# Altium schematic sheet PWM_Output.SchDoc
size A; SheetNumber: 9; SheetTotal: 9
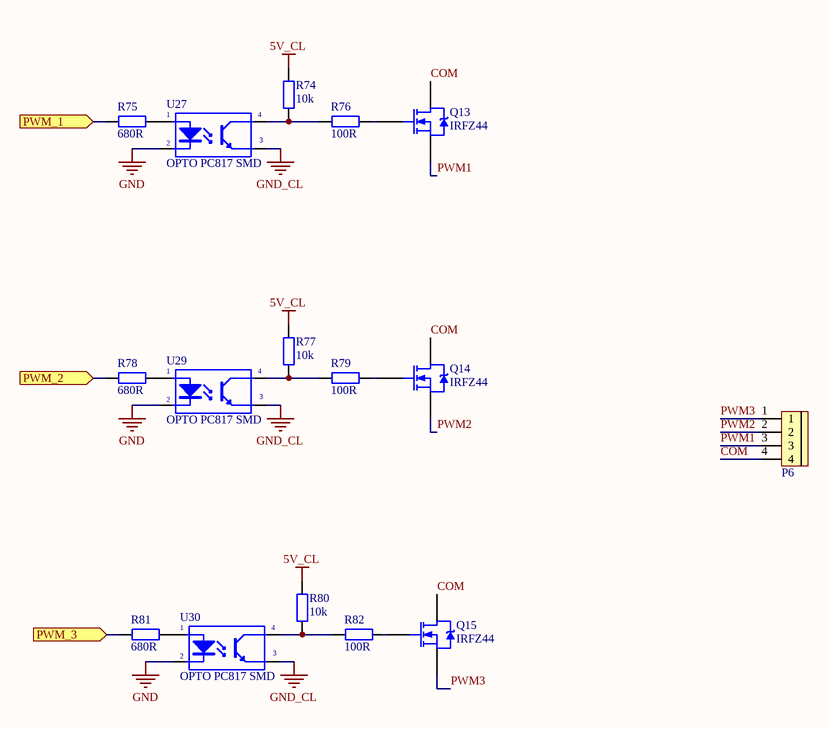
[diagram p0: PWM_Output.SchDoc]

## Parts
P6  CON 4 EDG5.08  [CON 4 4EDG5.08]  (value not drawn)
Q13  IRFZ44  [TO220]
Q14  IRFZ44  [TO220]
Q15  IRFZ44  [TO220]
R74  10k  [tro smd 0805]
R75  680R  [tro smd 0805]
R76  100R  [tro smd 0805]
R77  10k  [tro smd 0805]
R78  680R  [tro smd 0805]
R79  100R  [tro smd 0805]
R80  10k  [tro smd 0805]
R81  680R  [tro smd 0805]
R82  100R  [tro smd 0805]
U27  OPTO PC817 SMD  [SOP4]
U29  OPTO PC817 SMD  [SOP4]
U30  OPTO PC817 SMD  [SOP4]

## Ports
PWM_1 (in), PWM_2 (in), PWM_3 (in)

## Nets
5V_CL: R74.1 R77.1 R80.1
GND: U27.2(K) U29.2(K) U30.2(K)
GND_CL: U27.3(E) U29.3(E) U30.3(E)
COM: P6.4 Q13.2(D) Q14.2(D) Q15.2(D)
PWM1: P6.3 Q13.3(S)
PWM2: P6.2 Q14.3(S)
PWM3: P6.1 Q15.3(S)
PWM_1: R75.1 ; port PWM_1
PWM_2: R78.1 ; port PWM_2
PWM_3: R81.1 ; port PWM_3
NetQ13_1: Q13.1(G) R76.2
NetQ14_1: Q14.1(G) R79.2
NetQ15_1: Q15.1(G) R82.2
NetR74_2: R74.2 R76.1 U27.4(C)
NetR75_2: R75.2 U27.1(A)
NetR77_2: R77.2 R79.1 U29.4(C)
NetR78_2: R78.2 U29.1(A)
NetR80_2: R80.2 R82.1 U30.4(C)
NetR81_2: R81.2 U30.1(A)

## Library data of the parts
P6 = CON 4 EDG5.08: Cắm; Ten_Linh_Kien: CON 4 2EDG5.08-4P 5.08MM ( Xanh Cong); Ma_Hang: MH000979; Don_Vi: Con; Ghi_Chu: *; Kieu_Chan: *; Chung_Loai: Cắm
Q13-Q15 = IRFZ44 DIP: N-Channel Power MOSFET
R74 R77 R80 = Tro 0805 1% 10k: Dán; Don_Vi: Con; So_Chan: 2; Ten_Linh_Kien: Trở 0805 1% 10k; Ma_Hang: MH005473; Chung_Loai: Dán; Kieu_Chan: *
R75 R78 R81 = Tro 0805 1% 680R: Dán; Don_Vi: Con; So_Chan: 2; Ten_Linh_Kien: Trở 0805 1% 680R; Ma_Hang: MH005487; Chung_Loai: Dán; Kieu_Chan: *
R76 R79 R82 = Tro 0805 5% 100R: Dán; Don_Vi: Con; So_Chan: 2; Ten_Linh_Kien: Trở 0805 5% 100R; Ma_Hang: MH005251; Chung_Loai: Dán; Kieu_Chan: *
U27 U29 U30 = OPTO PC817 SMD: Single Opto; Value: PC817